# Altium schematic sheet GPIO_COMM.SchDoc
size A4; SheetNumber: 4; SheetTotal: 4
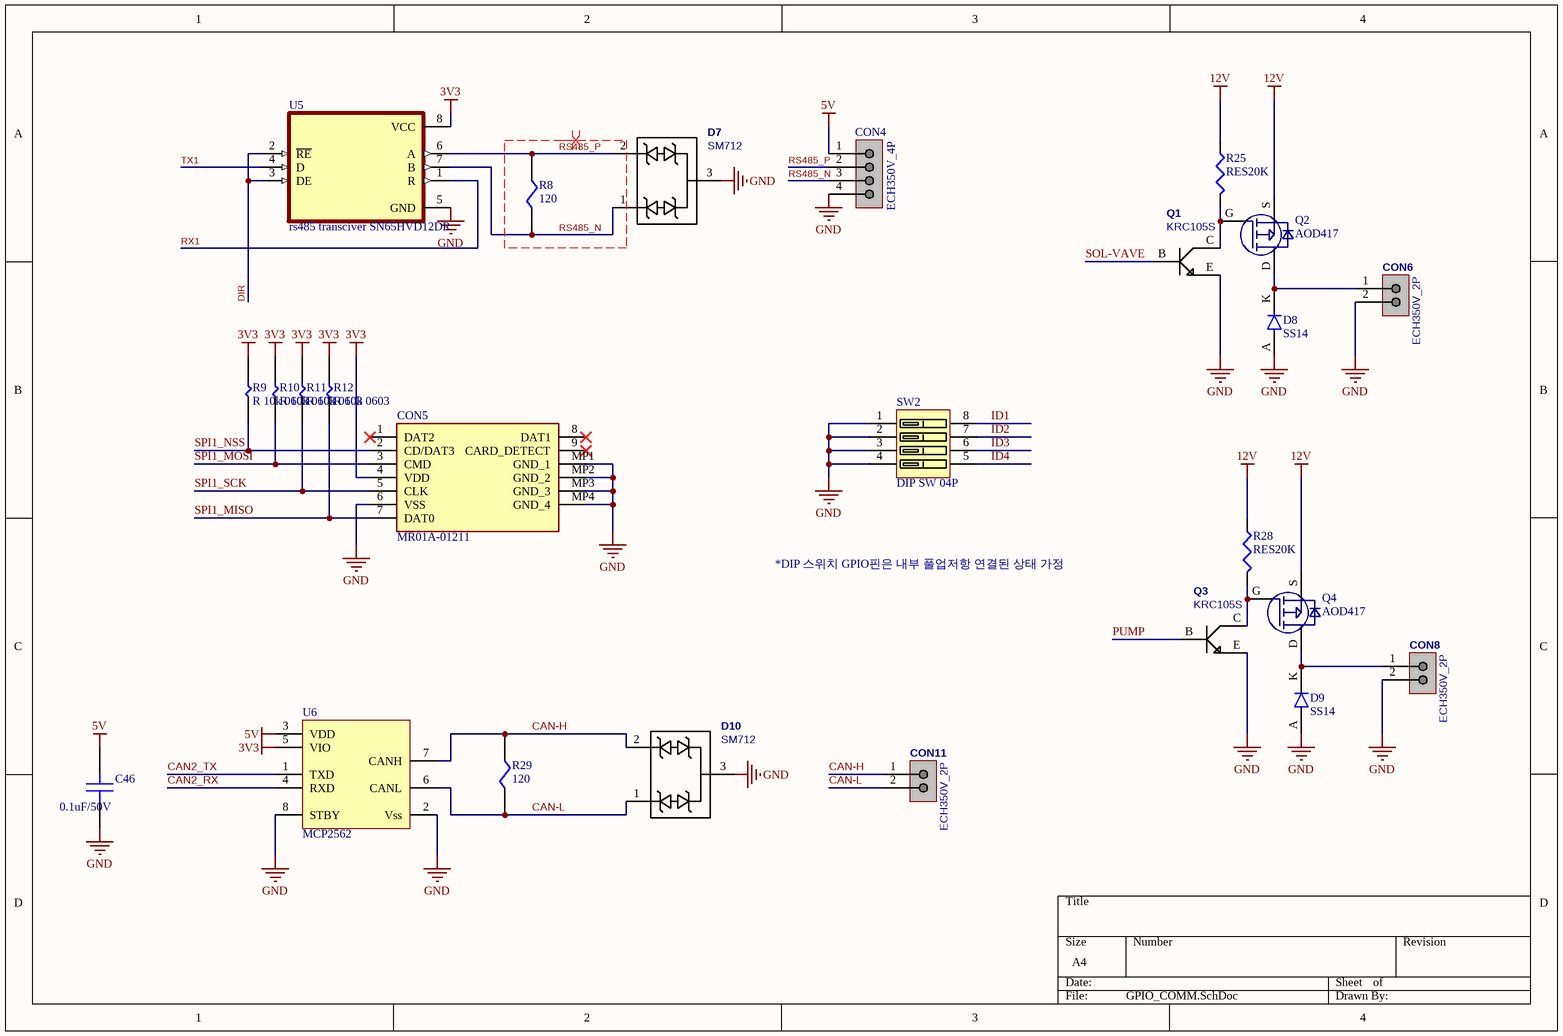
[diagram p0: GPIO_COMM.SchDoc]

## Parts
C46  0.1uF/50V  [CAP0.1u_0603_ceramic]
CON4  ECH350V_4P  [CON4P_ECH350V]
CON5  MR01A-01211  [MR01A-01211]
CON6  ECH350V_2P  [CON2P_ECH350V]
CON8  ECH350V_2P  [CON2P_ECH350V]
CON11  ECH350V_2P  [CON2P_ECH350V]
D7  SM712  [SM712]
D8  SS14  [DO-214AC]
D9  SS14  [DO-214AC]
D10  SM712  [SM712]
Q1  KRC105S  [NPN_KRC105S]
Q2  AOD417  [P-MOSFET_AOD417]
Q3  KRC105S  [NPN_KRC105S]
Q4  AOD417  [P-MOSFET_AOD417]
R8  120  [RES120_0805]
R9  R 10k 0603  [RES10K_0603]
R10  R 10k 0603  [RES10K_0603]
R11  R 10k 0603  [RES10K_0603]
R12  R 10k 0603  [RES10K_0603]
R25  RES20K  [RES20K_0603]
R28  RES20K  [RES20K_0603]
R29  120  [RES120_0805]
SW2  DIP SW 04P  [DIP SW 04P SMD (KHS42)]
U5  rs485 transciver SN65HVD12DR  [RS485_Transciver_SN65HVD12DR]
U6  MCP2562  [[CAN]MCP2562]

## Nets
3V3: CON5.4(VDD) R9.2 R10.2 R11.2 R12.2 U5.8(VCC) U6.5(VIO)
5V: C46.2 CON4.1 U6.3(VDD)
12V: Q2.S Q4.S R25.1 R28.1
GND: C46.1 CON4.4 CON5.6(VSS) CON5.MP1(GND_1) CON5.MP2(GND_2) CON5.MP3(GND_3) CON5.MP4(GND_4) CON6.2 CON8.2 D7.3 D8.A D9.A D10.3 Q1.E Q3.E SW2.1 SW2.2 SW2.3 SW2.4 U5.5(GND) U6.2(Vss) U6.8(STBY)
CAN2_RX: U6.4(RXD)
CAN2_TX: U6.1(TXD)
CAN-H: CON11.1 D10.2 R29.2 U6.7(CANH)
CAN-L: CON11.2 D10.1 R29.1 U6.6(CANL)
DIR: U5.2(~{RE}) U5.3(DE)
ID1: SW2.8
ID2: SW2.7
ID3: SW2.6
ID4: SW2.5
PUMP: Q3.B
RS485_N: CON4.3 D7.1 R8.1 U5.7(B)
RS485_P: CON4.2 D7.2 R8.2 U5.6(A)
RX1: U5.1(R)
SOL-VAVE: Q1.B
SPI1_MISO: CON5.7(DAT0) R12.1
SPI1_MOSI: CON5.3(CMD) R10.1
SPI1_NSS: CON5.2(CD/DAT3) R9.1
SPI1_SCK: CON5.5(CLK) R11.1
TX1: U5.4(D)
NetCON6_1: CON6.1 D8.K Q2.D
NetCON8_1: CON8.1 D9.K Q4.D
NetQ1_C: Q1.C Q2.G R25.2
NetQ3_C: Q3.C Q4.G R28.2

Not connected (* = marked no-connect by the designer): CON5 1(DAT2)* 8(DAT1)* 9(CARD_DETECT)*

## Layout directives
differential pair: RS485_N, RS485_P

## Notes on the sheet
- *DIP 스위치 GPIO핀은 내부 풀업저항 연결된 상태 가정

## Library data of the parts
C46 = CAP0.1u_0603_ceramic: cap, 0.1u 0603, 50V
CON4 = CON4P_ECH350V: Connector, Terminal block 4p_ECH350V
CON5 = MR01A-01211: MicroSD Card Connector
CON6 CON8 CON11 = CON2P_ECH350V: Header box, Header2x1_ECH350V
D7 D10 = SM712: SM712 Series 600W Asymmetrical TVS Diode Array
D8 D9 = SS14: Schottky Barrier Rectifiers
Q1 Q3 = NPN_KRC105S
Q2 Q4 = P-MOSFET_AOD417
R8 R29 = RES120_0805
R9-R12 = RES10K_0603
R25 R28 = RES20K: RES20K_0603
SW2 = DIP SW 04P: Switch
U5 = RS485_Transciver_SN65HVD12DR
U6 = [CAN]MCP2562: CAN Transceiver, SOIC127P600X175-8N, MCP2562-E/SN